# Altium project IsolationBoostConverter.PrjPCB
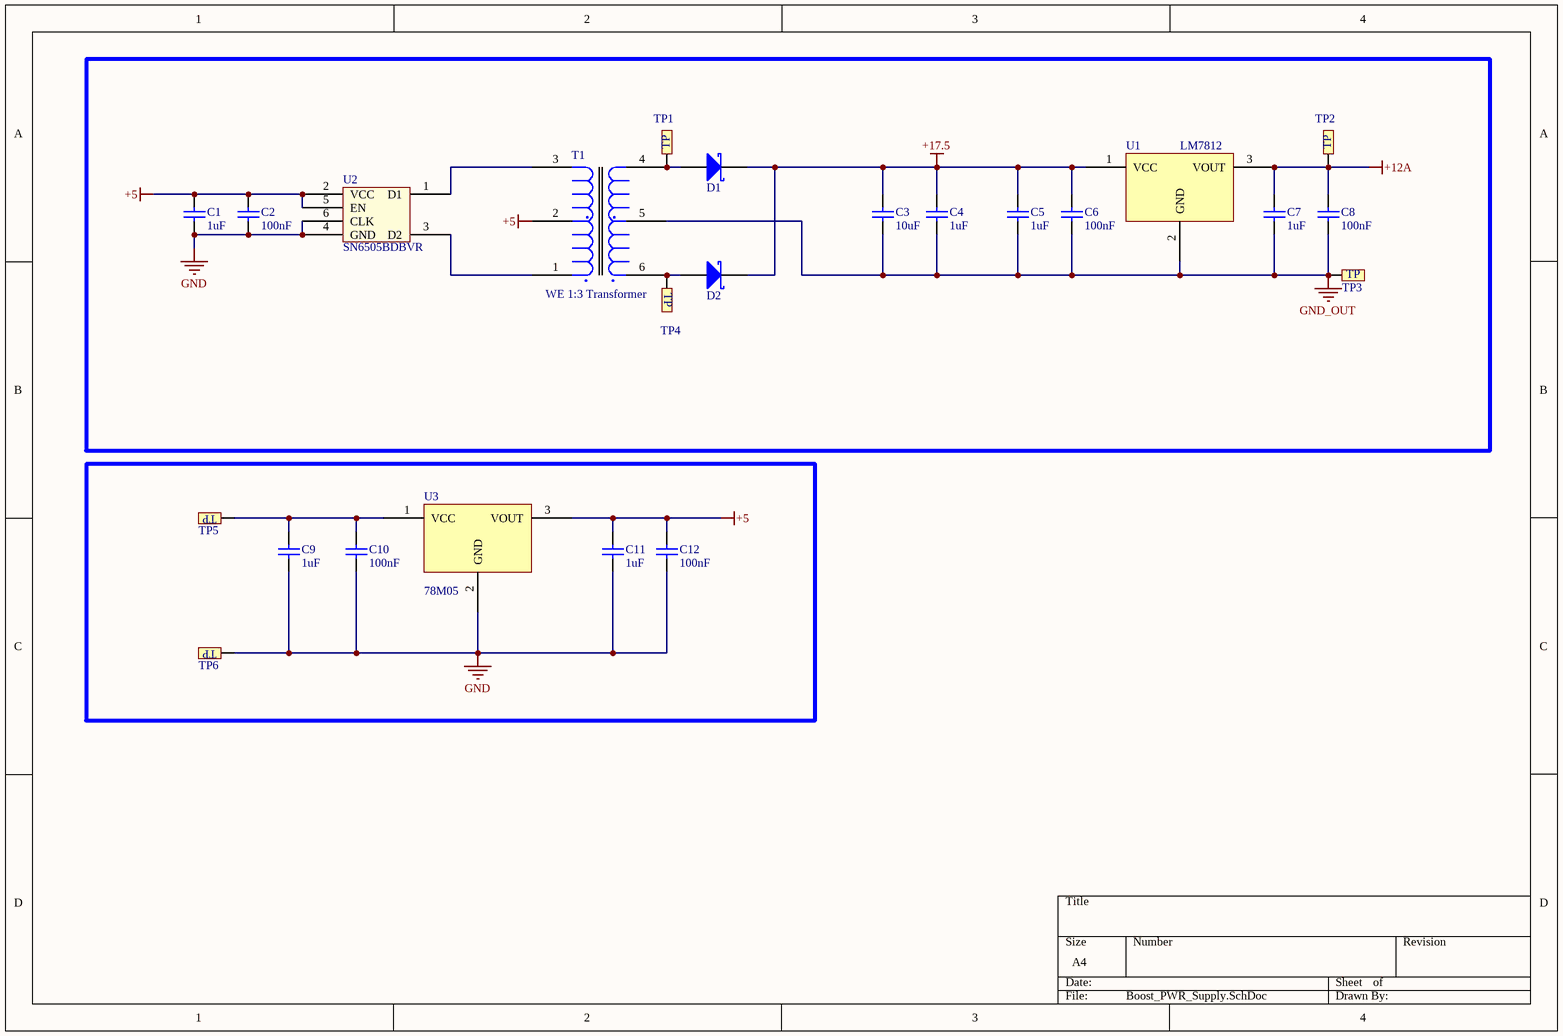
[diagram p0: Boost_PWR_Supply.SchDoc]
1 sheet, 24 parts. Net scope: global (net labels, ports and power ports of the same name join across sheets).
Board file: Boost_PWR_Supply.PcbDoc

## Sheet Boost_PWR_Supply.SchDoc
size A4

### Parts
C1  value 1uF  [CAP-SM-0805]  (hidden comment: Cap Non-Pol SMD)
C2  value 100nF  [CAP-SM-0805]  (hidden comment: Cap Non-Pol SMD)
C3  value 10uF  [CAP-SM-0805]  (hidden comment: Cap Non-Pol SMD)
C4  value 1uF  [CAP-SM-0805]  (hidden comment: Cap Non-Pol SMD)
C5  value 1uF  [CAP-SM-0805]  (hidden comment: Cap Non-Pol SMD)
C6  value 100nF  [CAP-SM-0805]  (hidden comment: Cap Non-Pol SMD)
C7  value 1uF  [CAP-SM-0805]  (hidden comment: Cap Non-Pol SMD)
C8  value 100nF  [CAP-SM-0805]  (hidden comment: Cap Non-Pol SMD)
C9  value 1uF  [CAP-SM-0805]  (hidden comment: Cap Non-Pol SMD)
C10  value 100nF  [CAP-SM-0805]  (hidden comment: Cap Non-Pol SMD)
C11  value 1uF  [CAP-SM-0805]  (hidden comment: Cap Non-Pol SMD)
C12  value 100nF  [CAP-SM-0805]  (hidden comment: Cap Non-Pol SMD)
D1  D Schottky  [SS34]  (value not drawn)
D2  D Schottky  [SS34]  (value not drawn)
T1  WE 1:3 Transformer  [750316818]
TP1  Test Point  [TP_2]  (value not drawn)
TP2  Test Point  [TP_2]  (value not drawn)
TP3  Test Point  [TP_2]  (value not drawn)
TP4  Test Point  [TP_2]  (value not drawn)
TP5  Test Point  [TP_2]  (value not drawn)
TP6  Test Point  [TP_2]  (value not drawn)
U1  LM7812  [DPAK228P1014X239-3N]
U2  SN6505BDBVR  [SOT23-6]
U3  78M05  [DPAK228P1014X239-3N]

### Nets
+5: C1.2 C2.2 C11.2 C12.2 T1.2 U2.2(VCC) U2.5(EN) U3.3(VOUT)
+12A: C7.2 C8.2 TP2.TP1 U1.3(VOUT)
+17.5: C3.2 C4.2 C5.2 C6.2 D1.2(K) D2.2(K) U1.1(VCC)
GND: C1.1 C2.1 C9.1 C10.1 C11.1 C12.1 TP6.TP1 U2.4(GND) U2.6(CLK) U3.2(GND)
GND_OUT: C3.1 C4.1 C5.1 C6.1 C7.1 C8.1 T1.5 TP3.TP1 U1.2(GND)
NetC9_2: C9.2 C10.2 TP5.TP1 U3.1(VCC)
NetD1_1: D1.1(A) T1.4 TP1.TP1
NetD2_1: D2.1(A) T1.6 TP4.TP1
NetT1_1: T1.1 U2.3(D2)
NetT1_3: T1.3 U2.1(D1)

### Notes on the sheet
- (in symbol Test Point) TP

### Library data of the parts
C1-C12 = Cap Non-Pol SMD: Capacitor
D1 D2 = D Schottky: Schottky Diode; Published: 8-Jun-2000; LatestRevisionDate: 17-Jul-2002; LatestRevisionNote: Re-released for DXP Platform.; PackageReference: SMB; Publisher: Altium Limited; PackageDescription: DO-214-AA/SMB; 2 C-Bend Leads; Body 5.3 x 3.6 mm, inc. leads (LxW); Code_JEDEC: DO-214-AA
T1 = WE 1:3.5 Transformer: Manufacturer: Wurth Elektronik; ComponentLink1Description: Supplier 1 Link; ComponentLink1URL: https://www.mouser.vn/ProductDetail/Wurth-Elektronik/750316818?qs=%2Fha2pyFaduhwWLO%2FwuaxPfkbn2Vm0sf%2F6JG8uX8izSO8%2FxDOwuQ00g%3D%3D; Manufacturer P/N: 750316818; Supplier 1: Mouser; Supplier 1 P/N: 710-750316818
U1 U3 = LM78xx
U2 = SN6505BDBVR: IC TRANSFORMER DRIVER SOT23-6; Manufacturer: Texas Instrument; Manufacturer Part Number: SN6505BDBVR; Supplier 1: Digikey; Supplier 1 Link: https://www.digikey.com/en/products/detail/texas-instruments/SN6505BDBVR/5994596?s=N4IgTCBcDaIM4DsBsBWADCgRgE0wNwCcQBdAXyA; Supplier 1 Part Number: 296-47311-2-ND